# EasyEDA Pro project ProPrj_大创集成版（原理图）_2025-12-10.epro

# Schematic Schematic1
Board Name: Board1; Create Date: 2025-10-27; Page Name: P1; Project Name: 大创集成版; Schematic Name: Schematic1; Update Date: 2025-11-03; Company: 嘉立创EDA; Page Size: A4; Version: V1.0
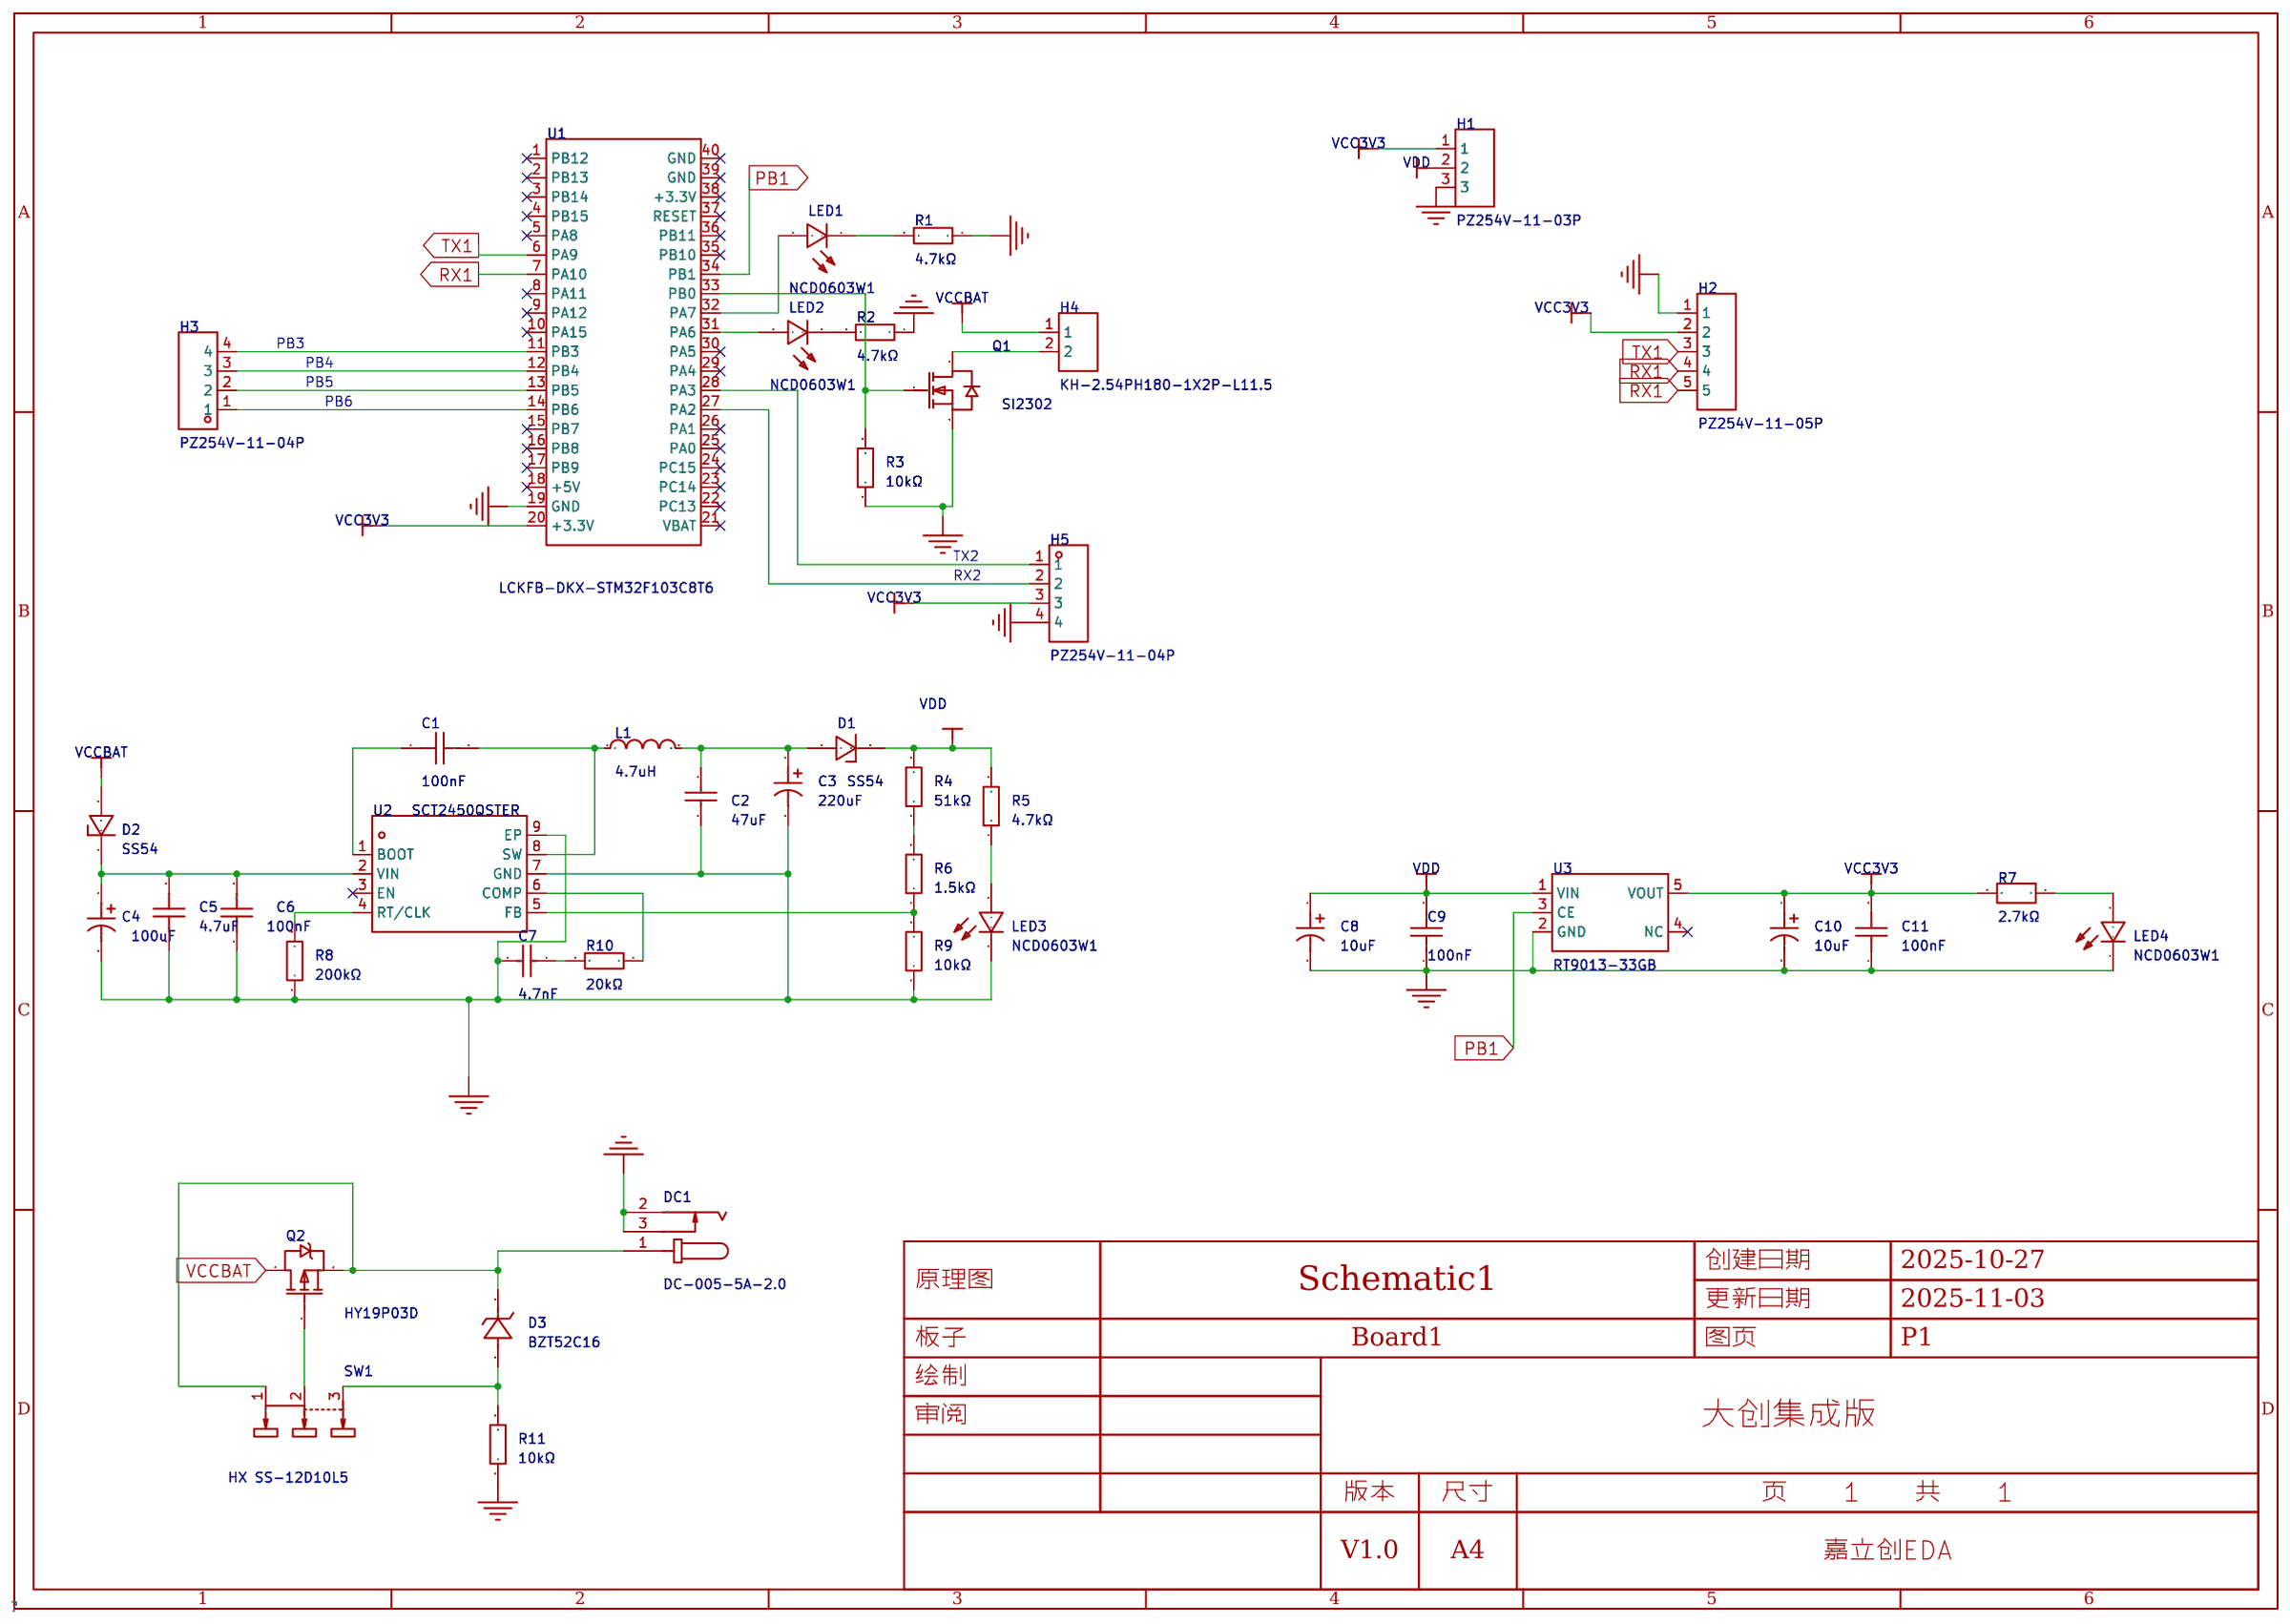
[diagram p0: schematic sheet]

## Parts
C1  100nF  [C0603]
C2  47uF  [C0603]
C3  220uF  [CAP-SMD_BD6.3-L6.6-W6.6-LS7.3-FD-H7.7]
C4  100uF  [CAP-SMD_BD6.3-L6.6-W6.6-FD-1]
C5  4.7uF  [C0603]
C6  100nF  [C0603]
C7  4.7nF  [C0603]
C8  10uF  [CAP-SMD_BD4.0-L4.3-W4.3-LS5.1-FD]
C9  100nF  [C0603]
C10  10uF  [CAP-SMD_BD4.0-L4.3-W4.3-LS5.1-FD]
C11  100nF  [C0603]
D1  SS54  [SMA_L4.3-W2.6-LS5.0-FD]
D2  SS54  [SMA_L4.3-W2.6-LS5.0-FD]
D3  BZT52C16  [SOD-123_L2.7-W1.6-LS3.7-RD]
DC1  DC-005-5A-2.0  [DC-IN-TH_DC-005-5A-2.0]
H1  PZ254V-11-03P  [HDR-TH_3P-P2.54-V-M]
H2  PZ254V-11-05P  [HDR-TH_5P-P2.54-V-M]
H3  PZ254V-11-04P  [HDR-TH_4P-P2.54-V-M]
H4  KH-2.54PH180-1X2P-L11.5  [HDR-TH_2P-P2.54-V-M]
H5  PZ254V-11-04P  [HDR-TH_4P-P2.54-V-M]
L1  4.7uH  [IND-SMD_L4.0-W4.0_FNR40XXS]
LED1  NCD0603W1  [LED0603-RD]
LED2  NCD0603W1  [LED0603-RD]
LED3  NCD0603W1  [LED0603-RD]
LED4  NCD0603W1  [LED0603-RD]
Q1  SI2302  [SOT-23-3_L2.9-W1.3-P1.90-LS2.4-BR]
Q2  HY19P03D  [TO-252-2_L6.6-W6.1-P4.57-LS9.9-TL-CW]
R1  4.7kΩ  [R0603]
R2  4.7kΩ  [R0603]
R3  10kΩ  [R0603]
R4  51kΩ  [R0603]
R5  4.7kΩ  [R0603]
R6  1.5kΩ  [R0603]
R7  2.7kΩ  [R0603]
R8  200kΩ  [R0603]
R9  10kΩ  [R0603]
R10  20kΩ  [R0603]
R11  10kΩ  [R0603]
SW1  HX SS-12D10L5  [SW-TH_HX-SS-12D10L5]
U1  LCKFB-DKX-STM32F103C8T6  [CONN-TH_L53.3-W22.9_STM32F103C8T6-CARD]
U2  SCT2450QSTER  [ESOP-8_L4.9-W3.9-P1.27-LS6.0-BL-EP]
U3  RT9013-33GB  [SOT-23-5_L2.9-W1.6-P0.95-LS2.8-BR]

## Library data of the parts
C1 C6 C9 C11 = CL10B104KB8NNNC: 容值:100nF;精度:±10%;额定电压:50V;温度系数:X7R;; LCSC Part Name: 100nF ±10% 50V; Supplier Part: C1591; Manufacturer: SAMSUNG(三星); Supplier Footprint: 0603; JLCPCB Part Class: 扩展库; Datasheet: https://item.szlcsc.com/datasheet/CL10B104KB8NNNC/1943.html; Supplier: LCSC; Tolerance: ±10%; Voltage Rating: 50V; Temperature Coefficient: X7R
C2 = GRM188R60J476ME15D: 容值:47uF;精度:±20%;额定电压:6.3V;温度系数:X5R;; LCSC Part Name: 47uF ±20% 6.3V; Supplier Part: C140782; Manufacturer: muRata(村田); Supplier Footprint: 0603; JLCPCB Part Class: 扩展库; Datasheet: https://item.szlcsc.com/datasheet/GRM188R60J476ME15D/152108.html; Supplier: LCSC; Tolerance: ±20%; Voltage Rating: 6.3V; Temperature Coefficient: X5R
C3 = JVJ25V220M6x8: 容值:220uF;精度:±20%;额定电压:25V;纹波电流:120mA@120Hz;; LCSC Part Name: 220uF ±20% 25V; Supplier Part: C46550404; Manufacturer: JIERR(捷而瑞); Supplier Footprint: SMD,D6.3xL7.7mm; JLCPCB Part Class: 扩展库; Datasheet: https://item.szlcsc.com/datasheet/JVJ25V220M6x8/48680098.html; Supplier: LCSC; Tolerance: ±20%; Voltage Rating: 25V; Ripple Current: 120mA@120Hz; Diameter: 6.3mm; Height - Seated (Max): 7.7mm; Lifetime: 2000hrs@105℃; Operating Temperature: -55℃~+105℃
C4 = JVJ25V100M6x5: 容值:100uF;精度:±20%;额定电压:25V;纹波电流:72mA@120Hz;; LCSC Part Name: 100uF ±20% 25V; Supplier Part: C46550402; Manufacturer: JIERR(捷而瑞); Supplier Footprint: SMD,D6.3xL5.4mm; JLCPCB Part Class: 扩展库; Datasheet: https://item.szlcsc.com/datasheet/JVJ25V100M6x5/48680096.html; Supplier: LCSC; Tolerance: ±20%; Voltage Rating: 25V; Ripple Current: 72mA@120Hz; Diameter: 6.3mm; Height - Seated (Max): 5.4mm; Lifetime: 2000hrs@105℃; Operating Temperature: -55℃~+105℃
C5 = CL10A475KO8NNNC: 容值:4.7uF;精度:±10%;额定电压:16V;温度系数:X5R;; LCSC Part Name: 4.7uF ±10% 16V; Supplier Part: C19666; Manufacturer: SAMSUNG(三星); Supplier Footprint: 0603; JLCPCB Part Class: 基础库; Datasheet: https://item.szlcsc.com/datasheet/CL10A475KO8NNNC/20375.html; Supplier: LCSC; Tolerance: ±10%; Voltage Rating: 16V; Temperature Coefficient: X5R
C7 = 0603B472K500NT: 容值:4.7nF;精度:±10%;额定电压:50V;温度系数:X7R;; LCSC Part Name: 4.7nF ±10% 50V; Supplier Part: C53987; Manufacturer: FH(风华); Supplier Footprint: 0603; JLCPCB Part Class: 基础库; Datasheet: https://item.szlcsc.com/datasheet/0603B472K500NT/55004.html; Supplier: LCSC; Tolerance: ±10%; Voltage Rating: 50V; Temperature Coefficient: X7R
C8 C10 = JVJ25V10M4x6: 容值:10uF;精度:±20%;额定电压:25V;纹波电流:14mA@120Hz;; LCSC Part Name: 10uF ±20% 25V; Supplier Part: C46550403; Manufacturer: JIERR(捷而瑞); Supplier Footprint: SMD,D4xL5.7mm; JLCPCB Part Class: 扩展库; Datasheet: https://item.szlcsc.com/datasheet/JVJ25V10M4x6/48680097.html; Supplier: LCSC; Tolerance: ±20%; Voltage Rating: 25V; Ripple Current: 14mA@120Hz; Diameter: 0.2mm; Height - Seated (Max): 5.7mm; Lifetime: 2000hrs@105℃; Operating Temperature: -55℃~+105℃
D1 D2 = SS54_C7420369: 二极管配置:独立式;正向压降(Vf):550mV@5.0A;直流反向耐压(Vr):40V;整流电流:5A;; LCSC Part Name: 电压:40V 电流:5A; Supplier Part: C7420369; Manufacturer: R+O(宏嘉诚); Supplier Footprint: SMA(DO-214AC); JLCPCB Part Class: Extended Part; Datasheet: https://item.szlcsc.com/datasheet/SS54/8397191.html; Supplier: LCSC; Diode Configuration: 独立式; Voltage - Forward(Vf@If): 550mV@5.0A; Voltage - DC Reverse(Vr): 40V; Current - Rectified: 5A; Reverse Leakage Current (Ir): 50uA@40V; Operating Junction Temperature Range: -55℃~+125℃; Non-Repetitive Peak Forward Surge Current: 120A
D3 = BZT52C16_C19077413: 二极管配置:独立式;稳压值(标称值):16V;稳压值(范围):15.2V~16.8V;耗散功率(Pd):350mW;; LCSC Part Name: 表面贴装齐纳二极管; Supplier Part: C19077413; Manufacturer: R+O(宏嘉诚); Supplier Footprint: SOD-123; JLCPCB Part Class: 扩展库; Datasheet: https://item.szlcsc.com/datasheet/BZT52C16/20275498.html; Supplier: LCSC; Diode Configuration: 独立式; Zener Voltage(Nom): 16V; Reverse Leakage Current (Ir): 100nA@11.2V; Zener Voltage(Range): 15.2V~16.8V; Pd - Power Dissipation: 350mW; Impedance(Zzt): 40Ω; Impedance(Zzk): 200Ω; Operating Junction Temperature Range: -55℃~+150℃
DC1 = DC-005-5A-2.0: 连接器类型:DC电源插座;安装方式:弯插;触点内径:2mm;触点外径:6.2mm;额定电流:5A;额定电压:24V;工作温度:-20℃~+70℃;; LCSC Part Name: DC电源插座 内径:2mm 外径:6.2mm; Supplier Part: C381116; Manufacturer: XKB Connection(中国星坤); Supplier Footprint: 插件; JLCPCB Part Class: 扩展库; Datasheet: https://item.szlcsc.com/datasheet/DC-005-5A-2.0/353348.html; Supplier: LCSC; Connector Type: DC电源插座; Mounting Type: 弯插; Inside Contact Diameter: 2mm; Outside Contact Diameter: 6.2mm; Current Rating: 5A; Voltage Rating (Max): 24V; Operating Temperature: -20℃~+70℃
H1 = PZ254V-11-03P: 插针结构:1x3P;间距:2.54mm;行距:-;圆针/方针:方针;安装方式:直插;排数:单排;总PIN位数:3P;额定电流:3A;额定电压:250V;配合针长度:6mm;塑高:2.5mm;端接针长度:3mm;工作温度:-40℃~+105℃;颜色:黑色;; LCSC Part Name: 1x3P 间距:2.54mm 方针 直插; Supplier Part: C2937625; Manufacturer: XFCN(兴飞); Supplier Footprint: 插件,P=2.54mm; JLCPCB Part Class: 扩展库; Datasheet: https://item.szlcsc.com/datasheet/PZ254V-11-03P/3293280.html; Supplier: LCSC; Pin Structure: 1x3P; Pitch: 2.54mm; Circluar Pins/Square Pins: 方针; Mounting Type: 直插; Number of Rows: 单排; Number of Pins: 3P; Current Rating: 3A; Voltage Rating (Max): 250V; Length of Mating Pin: 6mm; Insulation Height: 2.5mm; Length of End Connection Pin: 3mm; Operating Temperature: -40℃~+105℃; Color: 黑色
H2 = PZ254V-11-05P: 插针结构:1x5P;间距:2.54mm;行距:-;圆针/方针:方针;安装方式:直插;排数:单排;总PIN位数:5P;额定电流:-;额定电压:-;配合针长度:6mm;塑高:2.5mm;端接针长度:3mm;触头材质:黄铜;触头镀层:-;工作温度:-40℃~+105℃;颜色:黑色;; LCSC Part Name: 1x5P 间距:2.54mm 方针 直插; Supplier Part: C492404; Manufacturer: XFCN(兴飞); Supplier Footprint: 插件,P=2.54mm; JLCPCB Part Class: 扩展库; Datasheet: https://atta.szlcsc.com/upload/public/pdf/source/20200309/C492404_E51533260F8710EFF5D4617281164C1D.pdf; Supplier: LCSC; Pin Structure: 1x5P; Pitch: 2.54mm; Circluar Pins/Square Pins: 方针; Mounting Type: 直插; Number of Rows: 单排; Number of Pins: 5P; Length of Mating Pin: 6mm; Insulation Height: 2.5mm; Length of End Connection Pin: 3mm; Contact Material: 黄铜; Operating Temperature: -40℃~+105℃; Color: 黑色
H3 H5 = PZ254V-11-04P: 插针结构:1x4P;间距:2.54mm;行距:-;圆针/方针:方针;安装方式:直插;排数:单排;总PIN位数:4P;额定电流:3A;额定电压:250V;配合针长度:6mm;塑高:2.5mm;端接针长度:3mm;触头材质:-;工作温度:-40℃~+105℃;颜色:黑色;; LCSC Part Name: 1x4P 间距:2.54mm 方针 直插; Supplier Part: C2691448; Manufacturer: XFCN(兴飞); Supplier Footprint: 插件,P=2.54mm; JLCPCB Part Class: 扩展库; Datasheet: https://item.szlcsc.com/datasheet/PZ254V-11-04P/2801085.html; Supplier: LCSC; Pin Structure: 1x4P; Pitch: 2.54mm; Circluar Pins/Square Pins: 方针; Mounting Type: 直插; Number of Rows: 单排; Number of Pins: 4P; Current Rating: 3A; Voltage Rating (Max): 250V; Length of Mating Pin: 6mm; Insulation Height: 2.5mm; Length of End Connection Pin: 3mm; Operating Temperature: -40℃~+105℃; Color: 黑色
H4 = KH-2.54PH180-1X2P-L11.5: 插针结构:1x2P;间距:2.54mm;行距:-;圆针/方针:方针;安装方式:直插;排数:单排;总PIN位数:2P;额定电流:3A;额定电压:-;配合针长度:6mm;塑高:2.5mm;端接针长度:3mm;触头材质:-;工作温度:-40℃~+105℃;颜色:黑色;; LCSC Part Name: 1x2P 间距:2.54mm 方针 直插; Supplier Part: C2905434; Manufacturer: kinghelm(金航标); Supplier Footprint: 插件,P=2.54mm; JLCPCB Part Class: 扩展库; Datasheet: https://item.szlcsc.com/datasheet/KH-2.54PH180-1X2P-L11.5/3175222.html; Supplier: LCSC; Pin Structure: 1x2P; Pitch: 2.54mm; Circluar Pins/Square Pins: 方针; Mounting Type: 直插; Number of Rows: 单排; Number of Pins: 2P; Current Rating: 3A; Length of Mating Pin: 6mm; Insulation Height: 2.5mm; Length of End Connection Pin: 3mm; Operating Temperature: -40℃~+105℃; Color: 黑色
L1 = FNR4030S4R7MT: 电感值:4.7uH;精度:±20%;额定电流:2.3A;饱和电流(Isat):3.2A;类型:磁胶屏蔽绕线合金电感;; LCSC Part Name: 4.7uH ±20% 3.2A; Supplier Part: C167874; Manufacturer: cjiang(长江微电); Supplier Footprint: SMD,4x4mm; JLCPCB Part Class: 扩展库; Datasheet: https://atta.szlcsc.com/upload/public/pdf/source/20190327/C167925_9EFF0AABC4CA629C2CC95961DBF7D39D.pdf; Supplier: LCSC; Tolerance: ±20%; Current Rating: 2.3A; Current - Saturation(Isat): 3.2A; DC Resistance(DCR): 78mΩ; Type: 磁胶屏蔽绕线合金电感
LED1-LED4 = NCD0603W1: 发光颜色:白色;正向压降(Vf):2.6V~3.6V;功率:72mW;正向电流:20mA;透镜颜色:-;发光强度:300mcd;发光角度:130°;工作温度:-30℃~+85℃;; LCSC Part Name: 片式发光二极管; Supplier Part: C84265; Manufacturer: 国星光电; Supplier Footprint: 0603; JLCPCB Part Class: 扩展库; Datasheet: https://item.szlcsc.com/datasheet/NCD0603W1/85434.html; Supplier: LCSC; Illumination Color: 白色; Voltage - Forward(Vf): 2.6V~3.6V; Power(Watts): 72mW; Forward Current: 20mA; Luminous Intensity: 300mcd; Viewing Angle: 130°; Operating Temperature: -30℃~+85℃
Q1 = SI2302_C2891732: 数量:1个N沟道;漏源电压(Vdss):20V;连续漏极电流(Id):3A;导通电阻(RDS(on)):65mΩ@2.5V;耗散功率(Pd):1W;阈值电压(Vgs(th)):1V@250uA;; LCSC Part Name: N沟道,电流:3A,耐压:20V; Supplier Part: C2891732; Manufacturer: YONGYUTAI(永裕泰); Supplier Footprint: SOT-23; JLCPCB Part Class: 扩展库; Datasheet: https://item.szlcsc.com/datasheet/SI2302/3119651.html; Supplier: LCSC; Number: 1个N沟道; Drain to Source Voltage: 20V; Current - Continuous Drain(Id): 3A; RDS(on): 65mΩ@2.5V; Pd - Power Dissipation: 1W; Gate Threshold Voltage (Vgs(th)): 1V@250uA; Gate Charge(Qg): 4nC@4.5V; Input Capacitance(Ciss): 300pF; Reverse Transfer Capacitance (Crss@Vds): 80pF; Operating Temperature: -55℃~+150℃; Type: N沟道; Output Capacitance(Coss): 120pF
Q2 = HY19P03D: 类型:P沟道;漏源电压(Vdss):30V;连续漏极电流(Id):90A;功率(Pd):50W;导通电阻(RDS(on)@Vgs,Id):6mΩ@10V,45A;阈值电压(Vgs(th)@Id):3V@250uA;; LCSC Part Name: P沟道 耐压:30V 电流:90A; Supplier Part: C122492; Manufacturer: HUAYI(华羿微); Supplier Footprint: TO-252-2; JLCPCB Part Class: 扩展库; Datasheet: https://atta.szlcsc.com/upload/public/pdf/source/20170728/C122492_1501225751911848809.pdf; Supplier: LCSC; Type: P沟道; Drain Source Voltage (Vdss): 30V; Continuous Drain Current (Id): 90A; Power Dissipation (Pd): 50W; Drain Source On Resistance (RDS(on)@Vgs,Id): 6mΩ@10V,45A; Gate Threshold Voltage (Vgs(th)@Id): 3V@250uA
R1 R2 R5 = 0603WAF4701T5E: 电阻类型:厚膜电阻;阻值:4.7kΩ;精度:±1%;功率:100mW;工作电压:75V;温度系数:±100ppm/℃;; LCSC Part Name: 4.7kΩ ±1% 100mW 厚膜电阻; Supplier Part: C23162; Manufacturer: UNI-ROYAL(厚声); Supplier Footprint: 0603; JLCPCB Part Class: 基础库; Datasheet: https://item.szlcsc.com/datasheet/0603WAF4701T5E/23889.html; Supplier: LCSC; Type: 厚膜电阻; Tolerance: ±1%; Power(Watts): 100mW; Voltage-Supply(Max): 75V; Temperature Coefficient: ±100ppm/℃; Operating Temperature: -55℃~+155℃
R3 R9 R11 = 0603WAF1002T5E: 电阻类型:厚膜电阻;阻值:10kΩ;精度:±1%;功率:100mW;工作电压:75V;温度系数:±100ppm/℃;; LCSC Part Name: 厚膜电阻 10kΩ ±1% 100mW; Supplier Part: C25804; Manufacturer: UNI-ROYAL(厚声); Supplier Footprint: 0603; JLCPCB Part Class: 基础库; Datasheet: https://item.szlcsc.com/datasheet/0603WAF1002T5E/26547.html; Supplier: LCSC; Type: 厚膜电阻; Tolerance: ±1%; Power(Watts): 100mW; Voltage-Supply(Max): 75V; Temperature Coefficient: ±100ppm/℃; Operating Temperature: -55℃~+155℃
R4 = 0603WAF5102T5E: 电阻类型:厚膜电阻;阻值:51kΩ;精度:±1%;功率:100mW;工作电压:75V;温度系数:±100ppm/℃;; LCSC Part Name: 51kΩ ±1% 100mW 厚膜电阻; Supplier Part: C23196; Manufacturer: UNI-ROYAL(厚声); Supplier Footprint: 0603; JLCPCB Part Class: 基础库; Datasheet: https://item.szlcsc.com/datasheet/0603WAF5102T5E/23923.html; Supplier: LCSC; Type: 厚膜电阻; Tolerance: ±1%; Power(Watts): 100mW; Voltage-Supply(Max): 75V; Temperature Coefficient: ±100ppm/℃; Operating Temperature: -55℃~+155℃
R6 = 0603WAF1501T5E: 电阻类型:厚膜电阻;阻值:1.5kΩ;精度:±1%;功率:100mW;工作电压:75V;温度系数:±100ppm/℃;; LCSC Part Name: 1.5kΩ ±1% 100mW 厚膜电阻; Supplier Part: C22843; Manufacturer: UNI-ROYAL(厚声); Supplier Footprint: 0603; JLCPCB Part Class: 基础库; Datasheet: https://item.szlcsc.com/datasheet/0603WAF1501T5E/23570.html; Supplier: LCSC; Type: 厚膜电阻; Tolerance: ±1%; Power(Watts): 100mW; Voltage-Supply(Max): 75V; Temperature Coefficient: ±100ppm/℃; Operating Temperature: -55℃~+155℃
R7 = FRC0603F2701TS: 电阻类型:厚膜电阻;阻值:2.7kΩ;精度:±1%;功率:100mW;工作电压:75V;温度系数:±100ppm/℃;; LCSC Part Name: 2.7kΩ ±1% 100mW 厚膜电阻; Supplier Part: C2907008; Manufacturer: FOJAN(富捷); Supplier Footprint: 0603; JLCPCB Part Class: 扩展库; Datasheet: https://item.szlcsc.com/datasheet/FRC0603F2701TS/3180521.html; Supplier: LCSC; Type: 厚膜电阻; Tolerance: ±1%; Power(Watts): 100mW; Voltage-Supply(Max): 75V; Temperature Coefficient: ±100ppm/℃; Operating Temperature: -55℃~+155℃
R8 = 0603WAF2003T5E: 电阻类型:厚膜电阻;阻值:200kΩ;精度:±1%;功率:100mW;最大工作电压:75V;温度系数:±100ppm/℃;; LCSC Part Name: 200kΩ ±1% 100mW 厚膜电阻; Supplier Part: C25811; Manufacturer: UNI-ROYAL(厚声); Supplier Footprint: 0603; JLCPCB Part Class: 基础库; Datasheet: https://atta.szlcsc.com/upload/public/pdf/source/20200306/C422600_1E6D84923E4A46A82E41ADD87F860B5C.pdf; Supplier: LCSC; Type: 厚膜电阻; Tolerance: ±1%; Power(Watts): 100mW; Overload Voltage (Max): 75V; Temperature Coefficient: ±100ppm/℃; Operating Temperature Range: -55℃~+155℃
R10 = 0603WAF2002T5E: 电阻类型:厚膜电阻;阻值:20kΩ;精度:±1%;功率:100mW;工作电压:75V;温度系数:±100ppm/℃;; LCSC Part Name: 20kΩ ±1% 100mW 厚膜电阻; Supplier Part: C4184; Manufacturer: UNI-ROYAL(厚声); Supplier Footprint: 0603; JLCPCB Part Class: 基础库; Datasheet: https://item.szlcsc.com/datasheet/0603WAF2002T5E/4591.html; Supplier: LCSC; Type: 厚膜电阻; Tolerance: ±1%; Power(Watts): 100mW; Voltage-Supply(Max): 75V; Temperature Coefficient: ±100ppm/℃; Operating Temperature: -55℃~+155℃
SW1 = HX SS-12D10L5: 电路结构:单刀双掷;安装方式:弯插;开关颜色:黑色;额定电流:2A;额定电压:125V;工作寿命:5千次;; LCSC Part Name: 两档立式拨动柄长5mm 大电流2A; Supplier Part: C42391667; Manufacturer: hanxia(韩下); Supplier Footprint: SIP-3P,12.7x6.7mm; JLCPCB Part Class: 扩展库; Datasheet: https://item.szlcsc.com/datasheet/HX%2520SS-12D10L5/44326939.html; Supplier: LCSC; Circuit: 单刀双掷; Actuator Style: 矩形柱状; Termination Style: PC引脚; Length: 12.7mm; Width: 6.7mm; Switch Height: 6.4mm; Mounting Type: 弯插; Actuator Color: 黑色; Current Rating: 2A; Voltage Rating: 125V; Life: 5千次; Operating Temperature: -25℃~+70℃
U1 = LCKFB-DKX-STM32F103C8T6: LCSC Part Name: 立创·地阔星-STM32F103C8T6开发板; Supplier Part: C22396880; Manufacturer: 立创开发板; JLCPCB Part Class: 扩展库; Datasheet: https://item.szlcsc.com/datasheet/LCKFB-DKX-STM32F103C8T6/24005615.html; Supplier: LCSC
U2 = SCT2450QSTER: 工作电压:3.8V~36V;输出电流:5A;; LCSC Part Name: 3.8V-36V 输入，5A 输出，高效同步降压DC-DC转换器; Supplier Part: C2929524; Manufacturer: SCT(芯洲科技); Supplier Footprint: ESOP-8; JLCPCB Part Class: 扩展库; Datasheet: https://atta.szlcsc.com/upload/public/pdf/source/20211215/931D8B56C9B2E8CCF51B671F286E63AF.pdf; Supplier: LCSC; Input Voltage: 3.8V~36V; Output Current: 5A; Switching Frequency: 500kHz; Operating Temperature: -40℃~+125℃@(TJ); Synchronous Rectification: 是; Number of Outputs: 1; Switch tube (built-in/external): 内置
U3 = RT9013-33GB_C19268157: 输出类型:固定;工作电压:7V;输出电压:3.3V;输出电流:500mA;电源纹波抑制比(PSRR):70dB@(1kHz);输出极性:正极;; Supplier Part: C19268157; Manufacturer: TECH PUBLIC(台舟); Supplier Footprint: SOT-23-5; JLCPCB Part Class: 扩展库; Datasheet: https://item.szlcsc.com/datasheet/RT9013-33GB/20526335.html; Supplier: LCSC; Output Type: 固定; Voltage - Supply: 7V; Output Voltage: 3.3V; Output Current: 500mA; Power Supply Rejection Ratio (PSRR): 70dB@(1kHz); standby current: 60uA; Noise: 50uVrms; Features: 带使能; Operating Temperature: -40℃~+85℃; Output Configuration: 正极; Number of Outputs: 1

## Nets
GND: C2.1 C3.2 C4.2 C5.1 C6.1 C7.1 C8.2 C9.1 C10.2 C11.1 DC1.2 DC1.3 H1.3 H2.1 H5.4 LED3.1(-) LED4.1(-) Q1.2(S) R1.1 R2.1 R3.1 R8.1 R9.1 R11.1 U1.19(GND) U2.7(GND) U2.9(EP) U3.2(GND)
VCC3V3: C10.1 C11.2 H1.1 H2.2 H5.3 R7.2 U1.20(+3.3V) U3.5(VOUT)
VCCBAT: D2.1(A) H4.1 Q2.2(D)
VDD: C8.1 C9.2 D1.2(K) H1.2 R4.2 R5.2 U3.1(VIN)
PB1: U1.34(PB1) U3.3(CE)
PB3: H3.4 U1.11(PB3)
PB4: H3.3 U1.12(PB4)
PB5: H3.2 U1.13(PB5)
PB6: H3.1 U1.14(PB6)
RX1: H2.4 H2.5 U1.7(PA10)
RX2: H5.2 U1.27(PA2)
TX1: H2.3 U1.6(PA9)
TX2: H5.1 U1.28(PA3)
$1N825: H4.2 Q1.3(D)
$1N914: Q1.1(G) R3.2 U1.33(PB0)
$1N1296: Q2.1(G) SW1.2
$1N1305: D3.2(A) R11.2 SW1.3
$1N1351: D3.1(K) DC1.1 Q2.3(S) SW1.1
$1N2971: C4.1 C5.2 C6.2 D2.2(K) U2.2(VIN)
$1N3014: R8.2 U2.4(RT/CLK)
$1N3031: R10.1 U2.6(COMP)
$1N3036: C7.2 R10.2
$1N3135: C1.1 U2.1(BOOT)
$1N3139: C1.2 L1.1 U2.8(SW)
$1N3177: C2.2 C3.1 D1.1(A) L1.2
$1N3225: R6.1 R9.2 U2.5(FB)
$1N3253: LED3.2(+) R5.1
$1N3345: R4.1 R6.2
$1N4584: LED2.2(+) U1.31(PA6)
$1N4636: LED1.2(+) U1.32(PA7)
$1N4690: LED1.1(-) R1.2
$1N5333: LED4.2(+) R7.1
$1N8024: LED2.1(-) R2.2

Not connected (* = marked no-connect by the designer): U1 1(PB12)* 2(PB13)* 3(PB14)* 4(PB15)* 5(PA8)* 8(PA11)* 9(PA12)* 10(PA15)* 15(PB7)* 16(PB8)* 17(PB9)* 18(+5V)* 21(VBAT)* 22(PC13)* 23(PC14)* 24(PC15)* 25(PA0)* 26(PA1)* 29(PA4)* 30(PA5)* 35(PB10)* 36(PB11)* 37(RESET)* 38(+3.3V)* 39(GND)* 40(GND)*; U2 3(EN)*; U3 4(NC)*

# Board PCB1
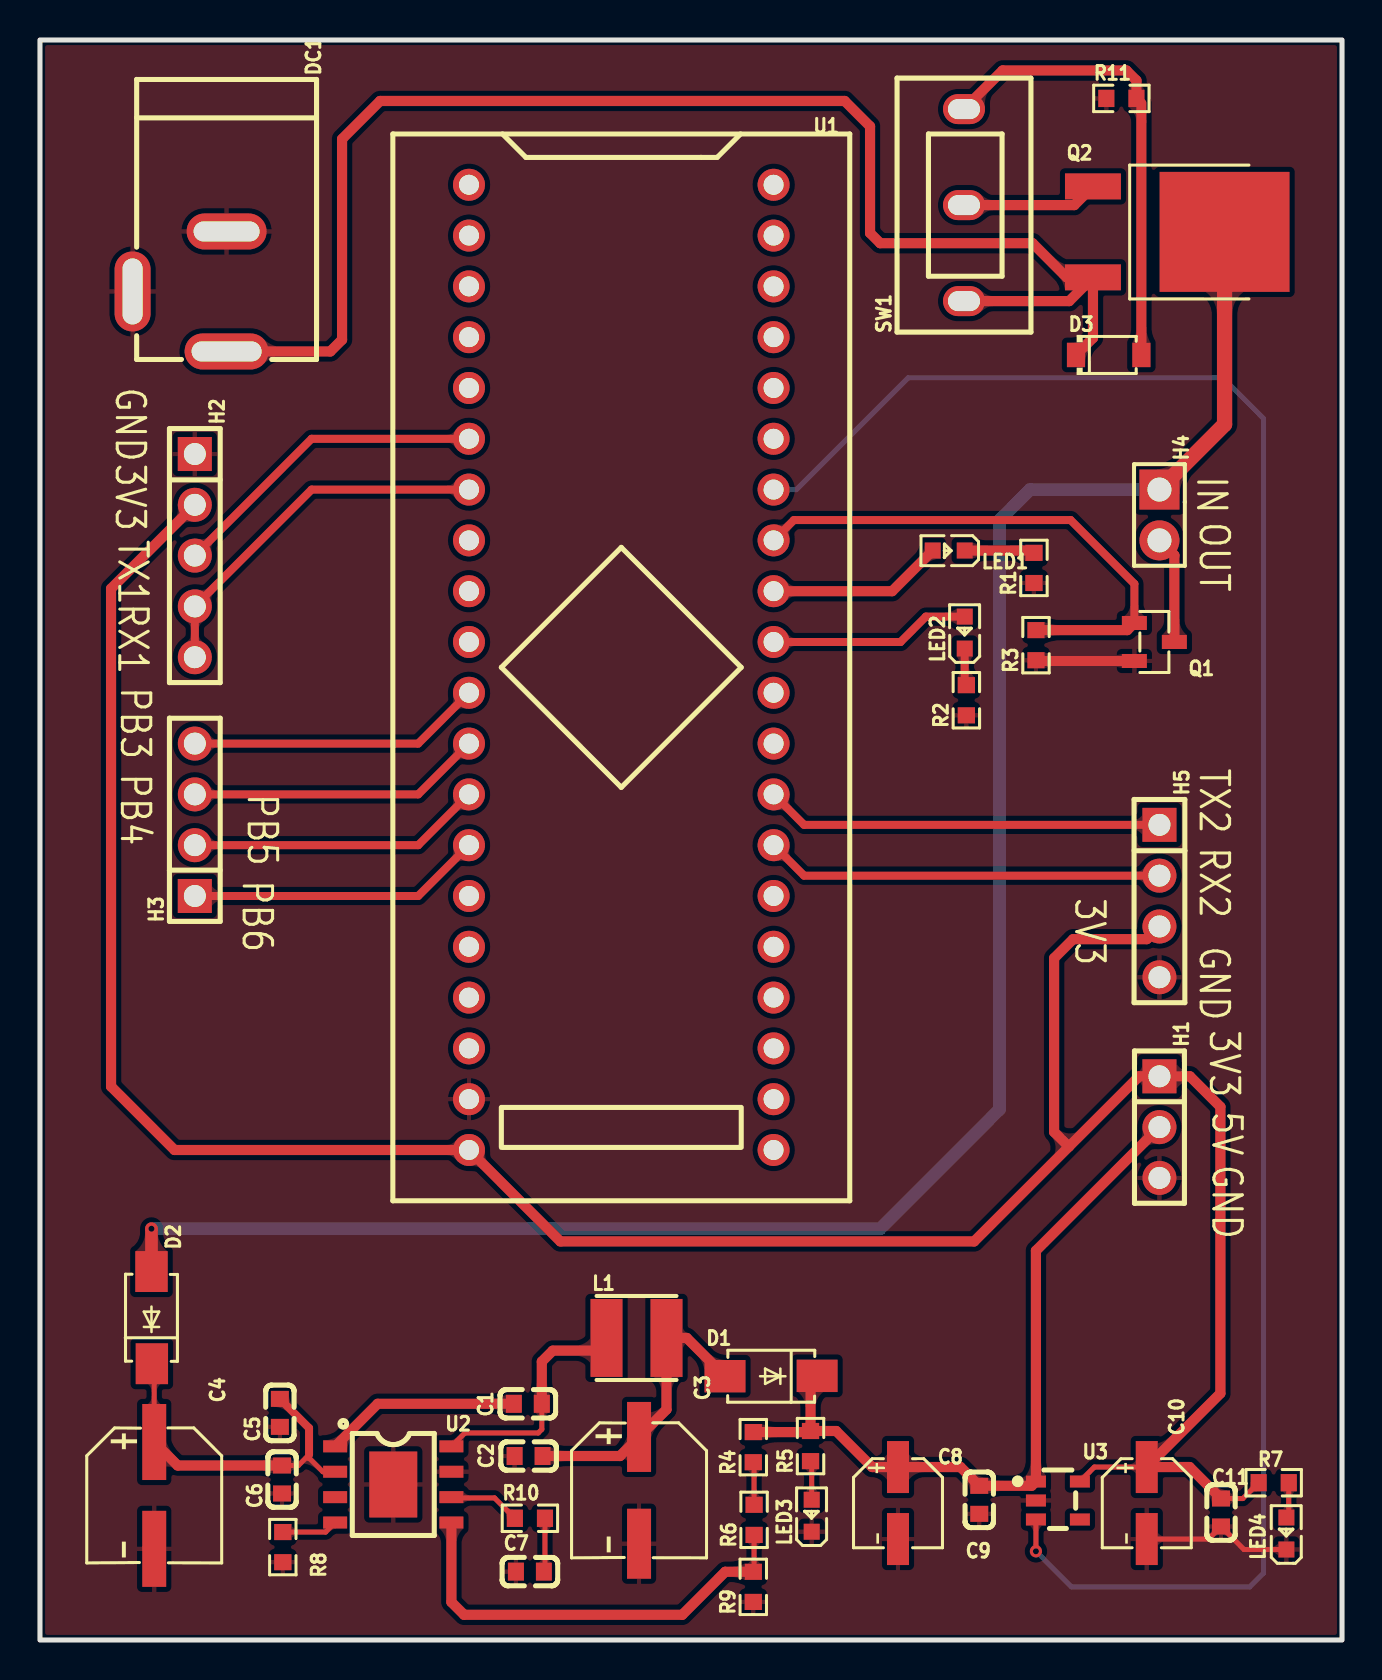
[diagram p1: board, top side]
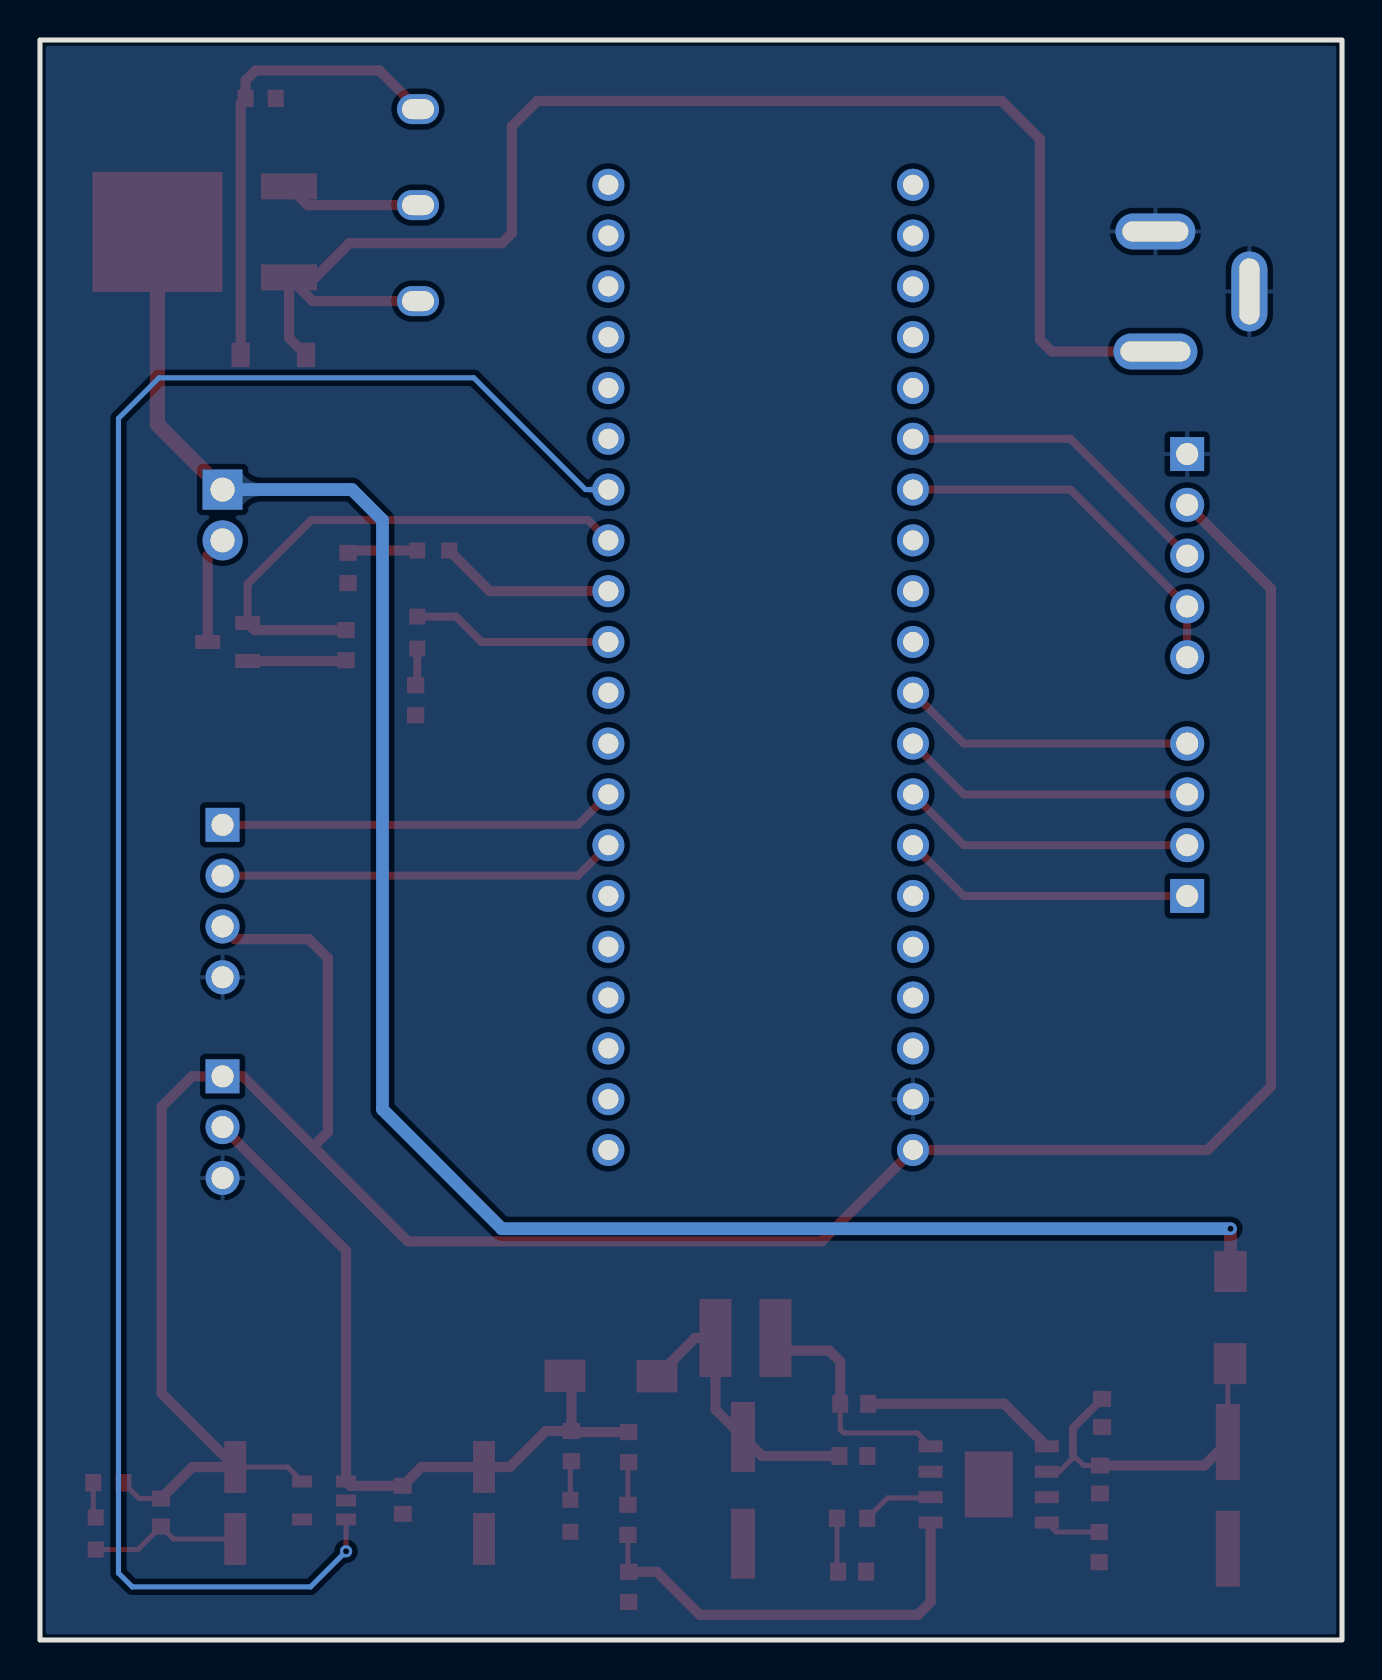
[diagram p2: board, bottom side, seen from below]

Outline 65.14 x 80 mm; copper layers: Top Layer, Bottom Layer. Coordinates in mm from the lower left corner of the outline.
Outline path: rectangle 0,80 65.14,0
Stack: Top Layer 0.035mm / Dielectric1 1.51mm FR4 er 4.5 / Bottom Layer 0.035mm

## Design rules (mm)
spacing copperThickness1oz (default): track to track 0.102, other pairs 0.152 to 0.3
spacing copperThickness2oz: track to track 0.203, other pairs 0.152 to 0.3
spacing Plane_innerPlane: track to track 0.102, other pairs 0.152 to 0.3
spacing Copper_copperRegion: track to track 0.102, other pairs 0.152 to 0.3
track width copperThickness1oz (default): min 0.127, default 0.254, max 2.54
track width copperThickness2oz: min 0.508, default 0.508, max 2.54
differential pair differentialPair (default): width min 0.127, default 0.254, max 2.54; gap min 0.152, default 0.152
net VCC3V3 uses copperThickness2oz
net VDD uses copperThickness2oz
net VCCBAT uses copperThickness2oz

## Placement (name value [footprint] x y rotation side)
C1  100nF  [C0603]  24.41 11.81 0 top
C2  47uF  [C0603]  24.45 9.2 0 top
C3  220uF  [CAP-SMD_BD6.3-L6.6-W6.6-LS7.3-FD-H7.7]  29.97 7.48 270 top
C4  100uF  [CAP-SMD_BD6.3-L6.6-W6.6-FD-1]  5.72 7.23 270 top
C5  4.7uF  [C0603]  12 11.36 90 top
C6  100nF  [C0603]  12.11 8.03 90 top
C7  4.7nF  [C0603]  24.51 3.42 0 top
C8  10uF  [CAP-SMD_BD4.0-L4.3-W4.3-LS5.1-FD]  42.93 6.85 270 top
C9  100nF  [C0603]  46.99 7.01 90 top
C10  10uF  [CAP-SMD_BD4.0-L4.3-W4.3-LS5.1-FD]  55.37 6.85 270 top
C11  100nF  [C0603]  59.09 6.37 90 top
D1  SS54  [SMA_L4.3-W2.6-LS5.0-FD]  36.58 13.2 0 top
D2  SS54  [SMA_L4.3-W2.6-LS5.0-FD]  5.59 16.12 270 top
D3  BZT52C16  [SOD-123_L2.7-W1.6-LS3.7-RD]  53.47 64.25 0 top
DC1  DC-005-5A-2.0  [DC-IN-TH_DC-005-5A-2.0]  6.98 67.43 270 top
H1  PZ254V-11-03P  [HDR-TH_3P-P2.54-V-M]  56.01 25.64 270 top
H2  PZ254V-11-05P  [HDR-TH_5P-P2.54-V-M]  7.75 54.22 270 top
H3  PZ254V-11-04P  [HDR-TH_4P-P2.54-V-M]  7.75 41.01 90 top
H4  KH-2.54PH180-1X2P-L11.5  [HDR-TH_2P-P2.54-V-M]  56.01 56.25 270 top
H5  PZ254V-11-04P  [HDR-TH_4P-P2.54-V-M]  56.01 36.95 270 top
L1  4.7uH  [IND-SMD_L4.0-W4.0_FNR40XXS]  29.85 15.1 0 top
LED1  NCD0603W1  [LED0603-RD]  45.47 54.47 180 top
LED2  NCD0603W1  [LED0603-RD]  46.27 50.37 90 top
LED3  NCD0603W1  [LED0603-RD]  38.61 6.21 90 top
LED4  NCD0603W1  [LED0603-RD]  62.36 5.32 90 top
Q1  SI2302  [SOT-23-3_L2.9-W1.3-P1.90-LS2.4-BR]  55.75 49.9 180 top
Q2  HY19P03D  [TO-252-2_L6.6-W6.1-P4.57-LS9.9-TL-CW]  55.97 70.41 0 top
R1  4.7kΩ  [R0603]  49.73 53.6 90 top
R2  4.7kΩ  [R0603]  46.35 46.99 90 top
R3  10kΩ  [R0603]  49.83 49.74 90 top
R4  51kΩ  [R0603]  35.69 9.64 90 top
R5  4.7kΩ  [R0603]  38.55 9.7 90 top
R6  1.5kΩ  [R0603]  35.73 6.01 90 top
R7  2.7kΩ  [R0603]  61.72 7.86 180 top
R8  200kΩ  [R0603]  12.15 4.64 90 top
R9  10kΩ  [R0603]  35.69 2.66 90 top
R10  20kΩ  [R0603]  24.51 6.09 0 top
R11  10kΩ  [R0603]  54.1 77.08 0 top
SW1  HX SS-12D10L5  [SW-TH_HX-SS-12D10L5]  46.23 71.75 90 top
U1  LCKFB-DKX-STM32F103C8T6  [CONN-TH_L53.3-W22.9_STM32F103C8T6-CARD]  29.08 48.63 270 top
U2  SCT2450QSTER  [ESOP-8_L4.9-W3.9-P1.27-LS6.0-BL-EP]  17.68 7.78 270 top
U3  RT9013-33GB  [SOT-23-5_L2.9-W1.6-P0.95-LS2.8-BR]  50.93 6.97 180 top

## Footprints (pads in the part's own frame, mm; a bottom-side part is the same pattern mirrored in y, then rotated)
C0603
  rect 0.8x0.9 smd: 1(-0.7,0) 2(0.7,0)
CAP-SMD_BD4.0-L4.3-W4.3-LS5.1-FD
  rect 2.6x1.1 smd: 1(-1.8,0) 2(1.8,0)
CAP-SMD_BD6.3-L6.6-W6.6-FD-1
  rect 3.8x1.2 smd: 1(-2.67,0) 2(2.67,0)
CAP-SMD_BD6.3-L6.6-W6.6-LS7.3-FD-H7.7
  rect 3.5x1.2 smd: 1(-2.67,0) 2(2.67,0)
CONN-TH_L53.3-W22.9_STM32F103C8T6-CARD
  round 1.6 hole 1: 1(-24.13,-7.62) 2(-21.59,-7.62) 3(-19.05,-7.62) 4(-16.51,-7.62) 5(-13.97,-7.62) 6(-11.43,-7.62) 7(-8.89,-7.62) 8(-6.35,-7.62) 9(-3.81,-7.62) 10(-1.27,-7.62) 11(1.27,-7.62) 12(3.81,-7.62) 13(6.35,-7.62) 14(8.89,-7.62) 15(11.43,-7.62) 16(13.97,-7.62) 17(16.51,-7.62) 18(19.05,-7.62) 19(21.59,-7.62) 20(24.13,-7.62) 21(24.13,7.62) 22(21.59,7.62) 23(19.05,7.62) 24(16.51,7.62) 25(13.97,7.62) 26(11.43,7.62) 27(8.89,7.62) 28(6.35,7.62) 29(3.81,7.62) 30(1.27,7.62) 31(-1.27,7.62) 32(-3.81,7.62) 33(-6.35,7.62) 34(-8.89,7.62) 35(-11.43,7.62) 36(-13.97,7.62) 37(-16.51,7.62) 38(-19.05,7.62) 39(-21.59,7.62) 40(-24.13,7.62)
DC-IN-TH_DC-005-5A-2.0
  oval 1.8x4.2 hole 1x3.5: 1(3,2.352)
  oval 1.8x4 hole 1x3.3: 2(-3,2.352)
  oval 4x1.8 hole 3.3x1: 3(-0.001,-2.352)
ESOP-8_L4.9-W3.9-P1.27-LS6.0-BL-EP
  rect 0.6x1.2 smd: 1(-1.905,-2.909) 2(-0.635,-2.909) 3(0.635,-2.909) 4(1.905,-2.909) 5(1.905,2.909) 6(0.635,2.909) 7(-0.635,2.909) 8(-1.905,2.909)
  rect 3.3x2.4 smd: 9(0,0)
HDR-TH_2P-P2.54-V-M
  rect 2x2 hole 1.2: 1(-1.27,0)
  round 2 hole 1.2: 2(1.27,0)
HDR-TH_3P-P2.54-V-M
  rect 1.7x1.7 hole 1.1: 1(-2.54,0)
  round 1.7 hole 1.1: 2(0,0) 3(2.54,0)
HDR-TH_4P-P2.54-V-M
  rect 1.7x1.7 hole 1.1: 1(-3.81,0)
  round 1.7 hole 1.1: 2(-1.27,0) 3(1.27,0) 4(3.81,0)
HDR-TH_5P-P2.54-V-M
  rect 1.7x1.7 hole 1.1: 1(-5.08,0)
  round 1.7 hole 1.1: 2(-2.54,0) 3(0,0) 4(2.54,0) 5(5.08,0)
IND-SMD_L4.0-W4.0_FNR40XXS
  rect 1.6x3.9 smd: 1(-1.5,0) 2(1.5,0)
LED0603-RD
  rect 0.8x0.8 smd: 1(-0.799,0) 2(0.799,0)
R0603
  rect 0.806x0.864 smd: 1(-0.753,0) 2(0.753,0)
SMA_L4.3-W2.6-LS5.0-FD
  rect 2.046x1.62 smd: 1(-2.304,-0.009) 2(2.304,0.009)
SOD-123_L2.7-W1.6-LS3.7-RD
  rect 0.91x1.22 smd: 1(-1.635,0) 2(1.635,0)
SOT-23-3_L2.9-W1.3-P1.90-LS2.4-BR
  rect 1.25x0.7 smd: 1(1,-0.95) 2(1,0.95) 3(-1,0)
SOT-23-5_L2.9-W1.6-P0.95-LS2.8-BR
  rect 1x0.6 smd: 1(1.1,-0.95) 2(1.1,0) 3(1.1,0.95) 4(-1.1,0.95) 5(-1.1,-0.95)
SW-TH_HX-SS-12D10L5
  oval 1.5x2.1 hole 1x1.6: 1(-4.8,0) 2(0,0) 3(4.8,0)
TO-252-2_L6.6-W6.1-P4.57-LS9.9-TL-CW
  rect 2.8x1.3 smd: 1(-3.292,2.273) 3(-3.292,-2.273)
  rect 6.5x6 smd: 2(3.292,0)

## Nets
As in the schematic.

Pads without a net: U1 1 2 3 4 5 8 9 10 15 16 17 18 21 22 23 24 25 26 29 30 35 36 37 38 39 40; U2 3; U3 4

## Via types
v1: diameter 0.61, hole 0.305, Top Layer to Bottom Layer, 2 vias

## Routing (per net, layer and track width the routed paths; a pad name or vN(x,y) marks a point on that pad's centre or on a via; arc(x,y) is an arc through that point)
GND: length 12.7
  Top Layer w0.254: C10.2 58.46,5.05 C11.1 60.24,4.52 LED4.1
  Top Layer w0.508: Q1.2 49.87,48.95 R3.1
VCC3V3: length 139.3
  Top Layer w0.254: R7.2 60.18,7.07 C11.2 ; U3.5 52.75,8.65 C10.1
  Top Layer w0.508: C11.2 57.51,8.65 C10.1 59.05,12.33 59.05,26.66 57.53,28.18 H1.1 ; 51.47,24.67 46.74,19.93 26.04,19.93 21.46,24.5 6.73,24.5 3.56,27.68 3.56,52.57 H2.2 ; 51.47,24.67 54.99,28.18 H1.1 ; 51.47,24.67 50.74,25.4 50.74,34.09 51.69,35.04 55.37,35.04 H5.3 ; 56.21,28.39 H1.1
VCCBAT: length 99.4
  Top Layer w0.635: D2.1 v1(5.58,20.56)
  Top Layer w0.762: Q2.2 59.27,60.78 H4.1
  Bottom Layer w0.635: H4.1 49.53,57.52 48.01,56 48.01,26.53 42.04,20.56 v1(5.58,20.56)
VDD: length 38.6
  Top Layer w0.508: D1.2 38.55,12.88 R5.2 ; R5.2 39.83,10.45 41.63,8.65 C8.1 46.05,8.65 C9.2 49.61,7.71 U3.1 49.83,19.46 H1.2 ; R5.2 38.5,10.4 R4.2
PB1: length 99.4
  Top Layer w0.254: U3.3 v1(49.83,4.44)
  Bottom Layer w0.254: U1.34 37.85,57.52 43.43,63.11 59.18,63.11 61.21,61.08 61.21,3.34 60.53,2.66 51.61,2.66 v1(49.83,4.44)
PB3: length 14.8
  Top Layer w0.4: H3.4 18.92,44.82 21.46,47.36
PB4: length 14.8
  Top Layer w0.4: U1.12 18.92,42.28 H3.3
PB5: length 14.8
  Top Layer w0.4: 21.46,42.28 18.92,39.74 H3.2
PB6: length 14.8
  Top Layer w0.4: U1.14 18.92,37.2 H3.1
RX1: length 18.7
  Top Layer w0.4: U1.7 13.59,57.52 H2.4 H2.5
RX2: length 19.9
  Top Layer w0.4: H5.2 38.23,38.22 U1.27
TX1: length 16.1
  Top Layer w0.4: H2.3 13.59,60.06 U1.6
TX2: length 19.9
  Top Layer w0.4: H5.1 38.23,40.76 36.7,42.28
$1N825: length 5.4
  Top Layer w0.508: H4.2 56.75,54.24 Q1.3
$1N914: length 26.8
  Top Layer w0.4: U1.33 37.72,56 51.56,56 54.75,52.81 Q1.1
  Top Layer w0.508: Q1.1 54.4,50.49 R3.2
$1N1296: length 6.8
  Top Layer w0.508: SW1.2 51.75,71.75 Q2.1
$1N1305: length 23.5
  Top Layer w0.254: 55.1,76.83 R11.2
  Top Layer w0.508: D3.2 55.1,76.83 ; R11.2 54.86,77.98 54.36,78.48 48.16,78.48 SW1.3
$1N1351: length 72.4
  Top Layer w0.508: DC1.1 14.53,64.43 15.11,65.01 15.11,75.05 17.02,76.95 40.26,76.95 41.53,75.68 41.53,70.35 42.04,69.84 49.66,69.84 51.36,68.13 Q2.3 ; Q2.3 52.68,65.1 D3.1 ; Q2.3 51.49,66.95 SW1.1
$1N2971: length 17.7
  Top Layer w0.254: 13.46,9.1 13.43,9.1 13.46,9.07 13.46,9.1 ; 13.46,9.1 14.15,8.41 U2.2 ; 13.46,9.1 13.46,9.26 12.93,8.72 C6.2 ; 5.6,13.81 5.72,13.7 C4.1
  Top Layer w0.4: C5.2 13.46,10.6 13.46,9.26
  Top Layer w0.508: C4.1 6.89,8.72 C6.2
$1N3014: length 2.8
  Top Layer w0.254: R8.2 14.29,5.4 U2.4
$1N3031: length 3.6
  Top Layer w0.254: U2.6 20.62,7.1 22.74,7.1 R10.1
$1N3036: length 2.7
  Top Layer w0.254: R10.2 25.26,3.47 C7.2
$1N3135: length 9.8
  Top Layer w0.508: C1.1 16.89,11.81 U2.1
$1N3139: length 12
  Top Layer w0.254: U2.8 21.25,10.35 24.93,10.35 25.11,10.53 C1.2
  Top Layer w0.508: L1.1 27.71,14.47 25.65,14.47 25.11,13.92 C1.2
$1N3177: length 14.5
  Top Layer w0.508: D1.1 32.36,15.1 L1.2 31.35,11.53 C3.1 29.02,9.2 C2.2
$1N3225: length 22.1
  Top Layer w0.254: 35.73,5.25 35.73,3.45 R9.2
  Top Layer w0.508: U2.5 20.58,1.9 21.22,1.26 32.13,1.26 34.28,3.41 R9.2
$1N3253: length 2
  Top Layer w0.254: LED3.2 38.61,8.89 R5.1
$1N3345: length 2.1
  Top Layer w0.254: R6.2 35.73,8.85 R4.1
$1N4584: length 10.1
  Top Layer w0.4: LED2.2 44.32,51.17 43.05,49.9 U1.31
$1N4636: length 8.8
  Top Layer w0.508: 36.7,52.44 42.63,52.44 LED1.2
$1N4690: length 3.5
  Top Layer w0.508: R1.2 49.61,54.47 LED1.1
$1N5333: length 1.8
  Top Layer w0.254: R7.1 62.48,6.24 LED4.2
$1N8024: length 1.9
  Top Layer w0.4: LED2.1 46.27,47.82 R2.2

## Copper pours and planes (outline as drawn; the poured copper is in the pictures)
GND on Top Layer: 0,80 65.14,80 65.14,0 0,0
GND on Top Layer: 0,80 64.95,80 64.95,0 0,0
GND on Bottom Layer: 0,79.73 65.14,79.73 65.14,0 0,0

Small or netless copper shapes (teardrops, artwork), in the pictures only: 110 on Top Layer, 3 on Bottom Layer

## Text on the board
Top Silkscreen Layer: GND | 3V3 | TX1 | RX1 | PB3 | PB4 | PB6 | PB5 | IN | OUT | TX2 | RX2 | 5V
